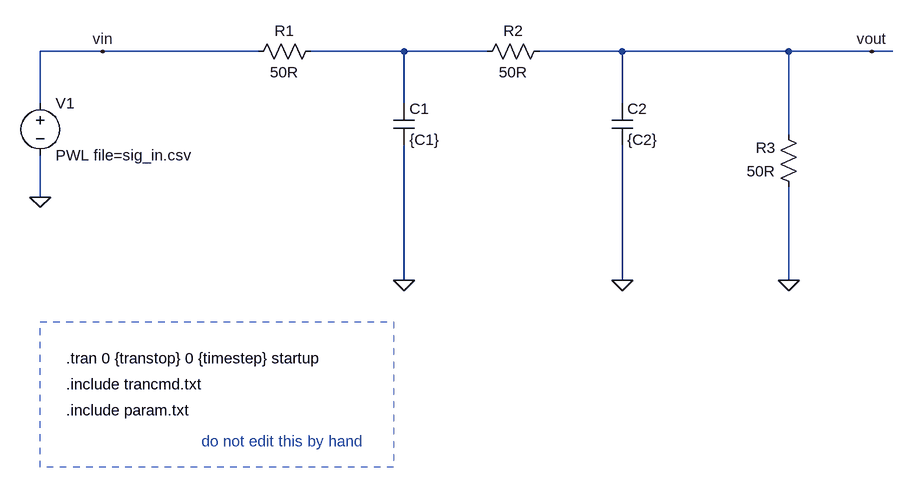
[diagram p0: schematic filter_circuit.asc]
filter_circuit.asc, the LTspice schematic file:
Version 4
SHEET 1 1532 740
WIRE 304 96 208 96
WIRE 544 96 304 96
WIRE 768 96 624 96
WIRE 896 96 768 96
WIRE 1104 96 976 96
WIRE 1360 96 1104 96
WIRE 1488 96 1360 96
WIRE 1520 96 1488 96
WIRE 208 176 208 96
WIRE 768 176 768 96
WIRE 1104 176 1104 96
WIRE 1360 224 1360 96
WIRE 208 320 208 256
WIRE 768 448 768 240
WIRE 1104 448 1104 240
WIRE 1360 448 1360 304
FLAG 304 96 vin
FLAG 208 320 0
FLAG 1488 96 vout
FLAG 768 448 0
FLAG 1104 448 0
FLAG 1360 448 0
SYMBOL voltage 208 160 R0
WINDOW 39 0 0 Left 0
SYMATTR InstName V1
SYMATTR Value PWL file=sig_in.csv
SYMBOL cap 752 176 R0
SYMATTR InstName C1
SYMATTR Value {C1}
SYMBOL res 992 80 R90
WINDOW 0 0 56 VBottom 2
WINDOW 3 32 56 VTop 2
SYMATTR InstName R2
SYMATTR Value 50R
SYMBOL cap 1088 176 R0
SYMATTR InstName C2
SYMATTR Value {C2}
SYMBOL res 1376 320 R180
WINDOW 0 36 76 Left 2
WINDOW 3 36 40 Left 2
SYMATTR InstName R3
SYMATTR Value 50R
SYMBOL res 640 80 R90
WINDOW 0 0 56 VBottom 2
WINDOW 3 32 56 VTop 2
SYMATTR InstName R1
SYMATTR Value 50R
TEXT 248 568 Left 2 !.tran 0 {transtop} 0 {timestep} startup
TEXT 248 648 Left 2 !.include param.txt
TEXT 248 608 Left 2 !.include trancmd.txt
TEXT 456 696 Left 2 ;do not edit this by hand
RECTANGLE Normal 752 736 208 512 2

The netlist it stands for:
* filter_circuit.asc
V1 vin 0 PWL file=sig_in.csv
C1 N001 0 {C1}
R2 vout N001 50R
C2 vout 0 {C2}
R3 0 vout 50R
R1 N001 vin 50R
.tran 0 {transtop} 0 {timestep} startup
.include param.txt
.include trancmd.txt
* do not edit this by hand
.backanno
.end